# EAGLE design proto_tracks11 (EAGLE 8.6.3)
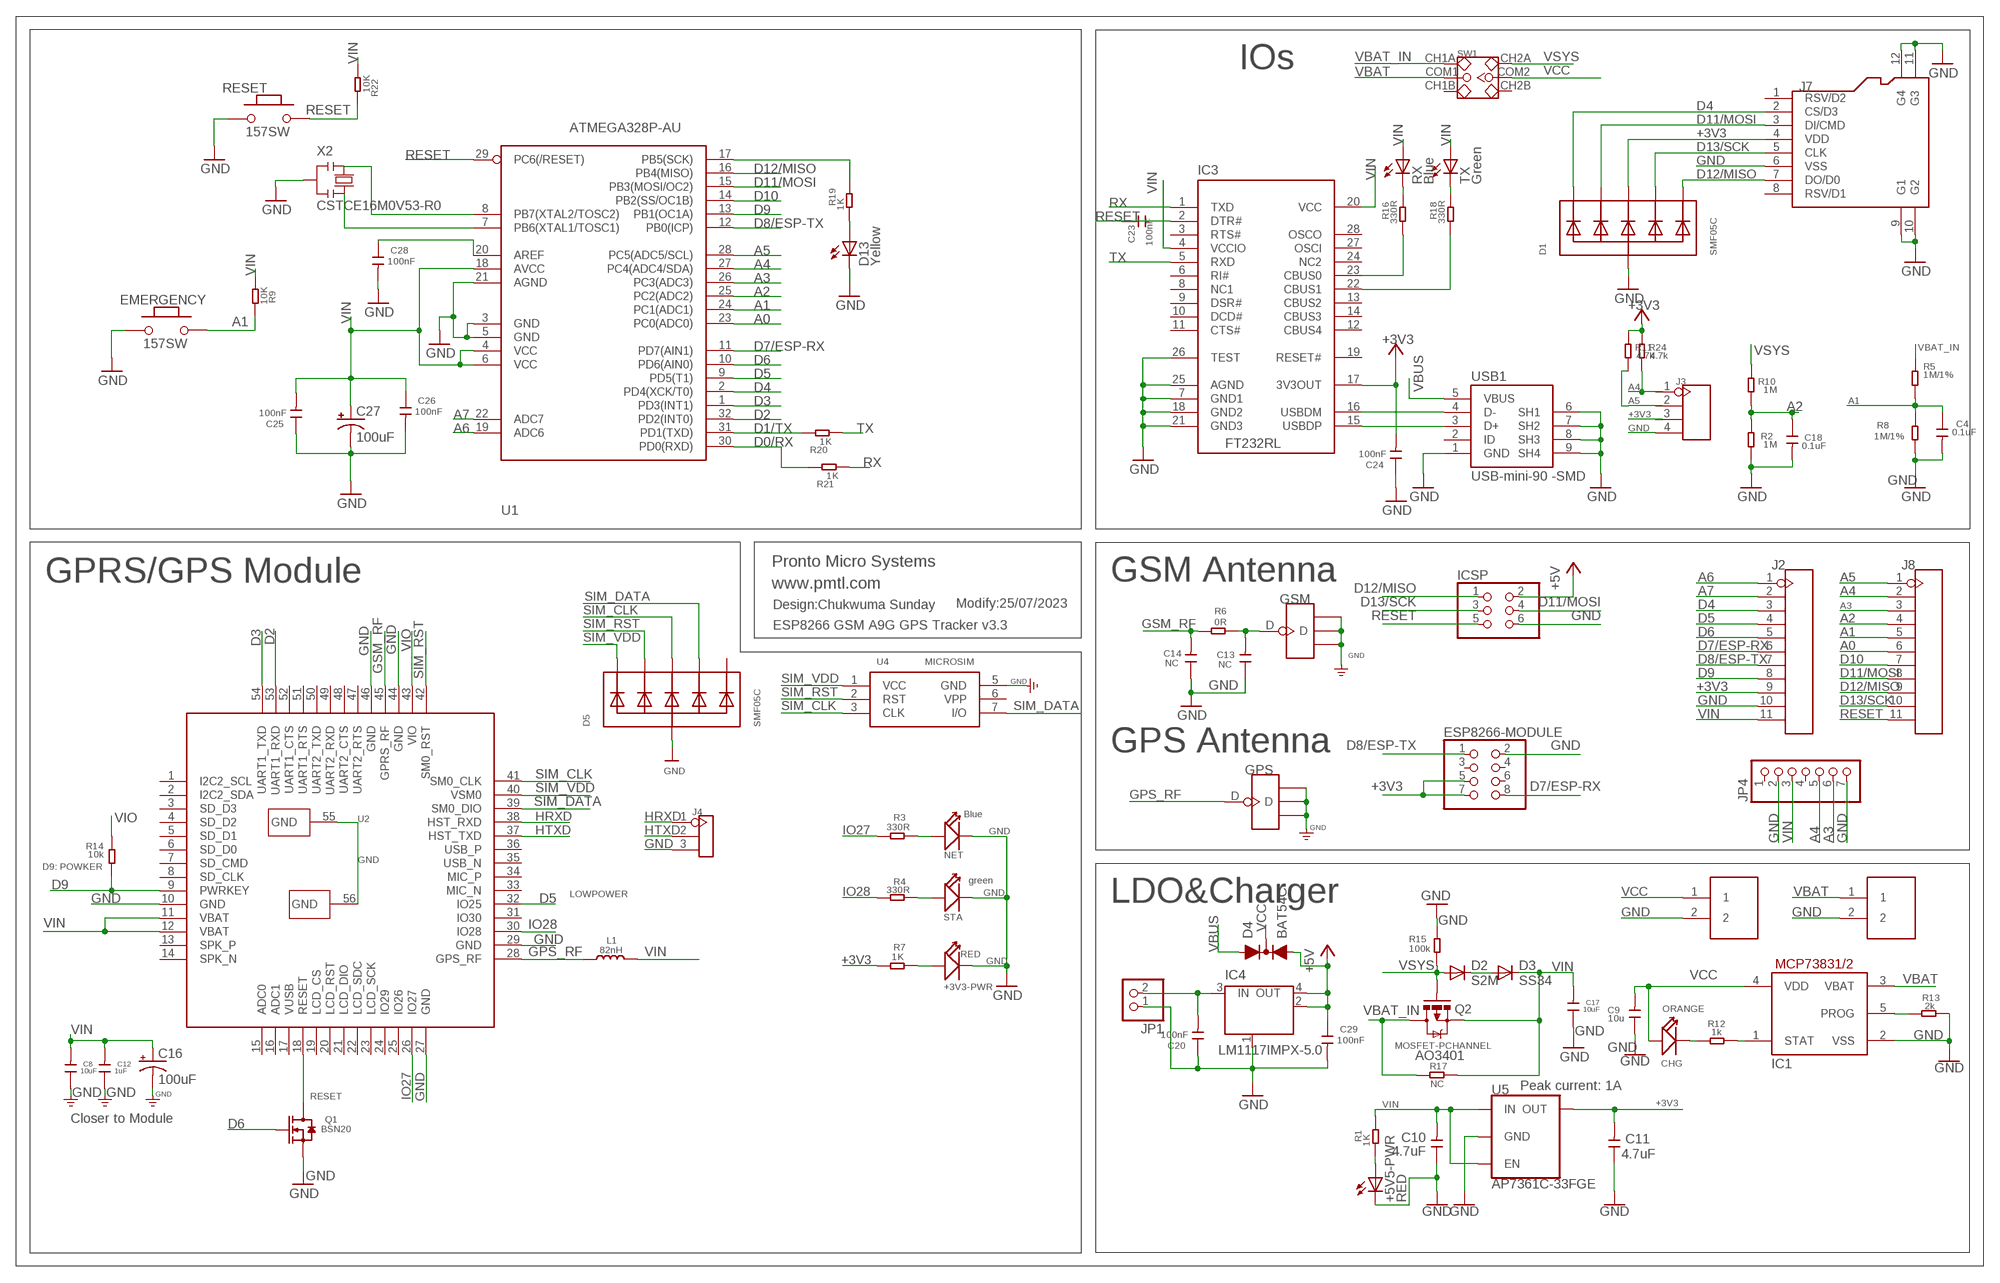
[diagram p0: schematic, sheet 1]

## Parts
+3V3-PWR  RED  LED'0603'  [LED-0603]
+5V5-PWR  RED  OPTO_0043_KPT-2012SGC  [OPTO_CHIPLED_0805]
C4  0.1uF  C-0603  [C0603]
C8  10uF  C-0603  [C0603]
C9  10u  C-0603  [C0603]
C10  4.7uF  C-0603  [C0603]
C11  4.7uF  C-0603  [C0603]
C12  1uF  C-0603  [C0603]
C13  NC  C-0402  [C0402]
C14  NC  C-0402  [C0402]
C16  100uF  68UF-POLAR-EIA3528-10V-10%(TANT)  [EIA3528]
C17  10uF  C-0603  [C0603]
C18  0.1uF  C-0603  [C0603]
C20  100nF  C-0603  [C0603]
C23  100nF  C-0603  [C0603]
C24  100nF  C-0603  [C0603]
C25  100nF  C-0603  [C0603]
C26  100nF  C-0603  [C0603]
C27  100uF  68UF-POLAR-EIA3528-10V-10%(TANT)  [EIA3528]
C28  100nF  C-0603  [C0603]
C29  100nF  C-0603  [C0603]
CHG  ORANGE  007-LED0603  [D0603]
D1  SMF05C  TVSARRAY_5LANE  [SOT363]
D2  S2M  DIODE-DO-214AC  [DO-214AC]
D3  SS34  DIODE-DO-214AC  [DO-214AC]
D4  BAT54C  [SOT23-R]
D5  SMF05C  TVSARRAY_5LANE  [SOT363]
D13  Yellow  OPTO_0044_KPT-2012YC  [OPTO_CHIPLED_0805]
EMERGENCY  157SW  SWITCHES_0173_IT-1185AP1C-160G-G_T&R  [SWITCHES_SMD_157SW]
ESP8266-MODULE  PINHD-2X4  [2X04]
GPS  ANTENNA-U-FL  [4P-U-FL]
GSM  ANTENNA-U-FL  [4P-U-FL]
IC1  MCP73831/OT  [SOT23-5L]
IC3  FT232RL  INTEGRATEDCIRCUITS_0226_FT232RL  [INTEGRATEDCIRCUITS_SSOP28]
IC4  LM1117IMPX-5.0  INTEGRATEDCIRCUITS_0022_LM1117IMPX-5.0  [INTEGRATEDCIRCUITS_LINEAR_SOT223]
ICSP  PINHD-2X3  [2X03]
J1  PH2.0-2P-90-DIP  [PH2.0-2P-90-DIP]
J2  HEADER-11P-2.54  [11P-2.54]
J3  HEADER-4P-60/35MILROUND  [4P-65/35ROUND]
J4  HEADER-3P-2.54  [3P-2.54]
J6  PH2.0-2P-90-DIP  [PH2.0-2P-90-DIP]
J7  HOLDER-MICROSD-8P  [8P-SMD]
J8  HEADER-11P-2.54  [11P-2.54]
JP1  PINHD-1X2  [1X02]
JP4  PINHD-1X7  [1X07]
L1  82nH  L'0603'  [L0603]
NET  Blue  LED'0603'  [LED-0603]
Q1  BSN20  MOSFET-N'SOT23'  [SOT23@1]
Q2  MOSFET-PCHANNEL  [SOT23-3]
R1  1K  R-0603  [R0603]
R2  1M  R-0603  [R0603]
R3  330R  R-0603  [R0603]
R4  330R  R-0603  [R0603]
R5  1M/1%  R-0603  [R0603]
R6  0R  R-0603  [R0603]
R7  1K  R-0603  [R0603]
R8  1M/1%  R-0603  [R0603]
R9  10K  R-0603  [R0603]
R10  1M  R-0603  [R0603]
R11  4.7k  R-0603  [R0603]
R12  1k  R-0603  [R0603]
R13  2k  R-0603  [R0603]
R14  10k  R-0603  [R0603]
R15  100k  R-0603  [R0603]
R16  330R  R-0603  [R0603]
R17  NC  R-0603  [R0603]
R18  330R  R-0603  [R0603]
R19  1K  R-0603  [R0603]
R20  1K  R-0603  [R0603]
R21  1K  R-0603  [R0603]
R22  10K  R-0603  [R0603]
R24  4.7k  R-0603  [R0603]
RESET  157SW  SWITCHES_0173_IT-1185AP1C-160G-G_T&R  [SWITCHES_SMD_157SW]
RX  Blue  OPTO_0181_KTP-2012SURCK  [OPTO_CHIPLED_0805]
STA  green  LED'0603'  [LED-0603]
SW1  SWITCH-2CH-6P  [6P-2CH-2.54-7.6X3.0]
TX  Green  OPTO_0043_KPT-2012SGC  [OPTO_CHIPLED_0805]
U1  ATMEGA328P-AU  ARDUINO-UCS&SOCS_ATMEGA328P-32AU  [ARDUINO-UCS&SOCS_TQFP32-08]
U2  A9G  [A9G]
U4  MICROSIM  [MICROSIM]
U5  AP7361C-33FGE  [8-UDFN]
USB1  USB-mini-90 -SMD  CONNETTORI_0219_14850  [CONNETTORI_USB-MINI-B_2]
X2  CSTCE16M0V53-R0  CRISTALLI_0011_CSTCE16M0V53-R0  [CRISTALLI_RESONATOR]

## Nets
+3V3: C11.2 C24.2 D1.4(C3) ESP8266-MODULE.5 ESP8266-MODULE.7 IC3.17(3V3OUT) J2.9 J3.3 J7.4(VDD) R7.1 R11.2 R24.2 U5.1(OUT)
+5V: C29.1 D4.2(A2) IC4.2(OUT) IC4.4(OUT) ICSP.2
A0: J8.6 U1.23(PC0(ADC0))
A1: C4.1 EMERGENCY.2 J8.5 R5.1 R8.2 R9.2 U1.24(PC1(ADC1))
A2: C18.1 J8.4 R2.2 R10.1 U1.25(PC2(ADC2))
A3: J8.3 JP4.6 U1.26(PC3(ADC3))
A4: J3.1 J8.2 JP4.5 R24.1 U1.27(PC4(ADC4/SDA))
A5: J3.2 J8.1 R11.1 U1.28(PC5(ADC5/SCL))
A6: J2.1 U1.19(ADC6)
A7: J2.2 U1.22(ADC7)
D0/RX: R21.2 U1.30(PD0(RXD))
D1/TX: R20.2 U1.31(PD1(TXD))
D2: U1.32(PD2(INT0)) U2.53(UART1_RXD)
D3: U1.1(PD3(INT1)) U2.54(UART1_TXD)
D4: D1.1(C1) J2.3 J7.2(CS/D3) U1.2(PD4(XCK/T0))
D5: J2.4 U1.9(PD5(T1)) U2.32(IO25)
D6: J2.5 Q1.1(G) U1.10(PD6(AIN0))
D7/ESP-RX: ESP8266-MODULE.8 J2.6 U1.11(PD7(AIN1))
D8/ESP-TX: ESP8266-MODULE.1 J2.7 U1.12(PB0(ICP))
D9: J2.8 R14.1 U1.13(PB1(OC1A)) U2.9(PWRKEY)
D10: J8.7 U1.14(PB2(SS/OC1B))
D11/MOSI: D1.3(C2) ICSP.4 J7.3(DI/CMD) J8.8 U1.15(PB3(MOSI/OC2))
D12/MISO: D1.6(C5) ICSP.1 J7.7(DO/D0) J8.9 U1.16(PB4(MISO))
D13/SCK: D1.5(C4) ICSP.3 J7.5(CLK) J8.10 R19.2 U1.17(PB5(SCK))
GND: +3V3-PWR.- +5V5-PWR.C C4.2 C8.1 C9.1 C10.1 C11.1 C12.1 C13.1 C14.1 C16.C(-) C17.1 C18.2 C20.1 C24.1 C25.1 C26.2 C27.C(-) C28.2 C29.2 D1.2(A) D5.2(A) D13.C EMERGENCY.1 ESP8266-MODULE.2 GPS.GND1 GPS.GND2 GPS.GND3 GSM.GND1 GSM.GND2 GSM.GND3 IC1.2(VSS) IC3.7(GND1) IC3.18(GND2) IC3.21(GND3) IC3.25(AGND) IC3.26(TEST) IC4.1(GND/ADJ) ICSP.6 J1.2 J2.10 J3.4 J4.3 J6.2 J7.6(VSS) J7.9(G1) J7.10(G2) J7.11(G3) J7.12(G4) JP1.1 JP4.2 JP4.7 NET.- Q1.2(S) R2.1 R8.1 R13.2 R15.2 RESET.1 STA.- U1.3(GND) U1.5(GND) U1.21(AGND) U2.10(GND) U2.27(GND) U2.29(GND) U2.44(GND) U2.46(GND) U2.55(GND) U2.56(GND) U4.5(GND) U5.4(GND) U5.EP(GND) USB1.1(GND) USB1.6(SH1) USB1.7(SH2) USB1.8(SH3) USB1.9(SH4) X2.2
GPS_RF: GPS.D L1.1 U2.28(GPS_RF)
GSM_RF: C14.2 R6.1 U2.45(GPRS_RF)
HRXD: J4.1 U2.38(HST_RXD)
HTXD: J4.2 U2.37(HST_TXD)
IO27: R3.1 U2.26(IO27)
IO28: R4.1 U2.30(IO28)
N$1: R4.2 STA.+
N$2: D2.C D3.A
N$3: +3V3-PWR.+ R7.2
N$4: C28.1 U1.20(AREF)
N$5: +5V5-PWR.A R1.1
N$6: C20.2 IC4.3(IN) JP1.2
N$7: NET.+ R3.2
N$8: Q1.3(D) U2.18(RESET)
N$9: C23.2 IC3.2(DTR#)
N$10: R16.2 RX.C
N$11: R18.2 TX.C
N$12: IC3.23(CBUS0) R16.1
N$13: IC3.22(CBUS1) R18.1
N$14: IC3.15(USBDP) USB1.3(D+)
N$15: IC3.16(USBDM) USB1.4(D-)
N$16: D13.A R19.1
N$25: CHG.- R12.1
N$26: IC1.1(STAT) R12.2
N$31: IC1.5(PROG) R13.1
N$44: U1.7(PB6(XTAL1/TOSC1)) X2.3
N$49: U1.8(PB7(XTAL2/TOSC2)) X2.1
N$94: C13.2 GSM.D R6.2
RESET: C23.1 ICSP.5 J8.11 R22.2 RESET.2 U1.29(PC6(/RESET))
RX: IC3.1(TXD) R21.1
SIM_CLK: D5.4(C3) U2.41(SM0_CLK) U4.3(CLK)
SIM_DATA: D5.5(C4) U2.39(SM0_DIO) U4.7(I/O)
SIM_RST: D5.3(C2) U2.42(SM0_RST) U4.2(RST)
SIM_VDD: D5.1(C1) U2.40(VSM0) U4.1(VCC)
TX: IC3.5(RXD) R20.1
VBAT: IC1.3(VBAT) J6.1 SW1.COM1
VBAT_IN: Q2.3(D) R5.2 R17.1 SW1.CH1A
VBUS: D4.1(A1) USB1.5(VBUS)
VCC: C9.2 CHG.+ D4.3(C) IC1.4(VDD) J1.1 SW1.COM2
VIN: C8.2 C10.2 C12.2 C16.A(+) C17.2 C25.2 C26.1 C27.A(+) D3.C IC3.4(VCCIO) IC3.20(VCC) J2.11 JP4.3 L1.2 Q2.2(S) R1.2 R9.1 R17.2 R22.1 RX.A TX.A U1.4(VCC) U1.6(VCC) U1.18(AVCC) U2.11(VBAT) U2.12(VBAT) U5.5(EN) U5.8(IN)
VIO: R14.2 U2.43(VIO)
VSYS: D2.A Q2.1(G) R10.2 R15.1 SW1.CH2A
Unconnected: D5.6(C5) ESP8266-MODULE.3 ESP8266-MODULE.4 ESP8266-MODULE.6 IC3.3(RTS#) IC3.6(RI#) IC3.8(NC1) IC3.9(DSR#) IC3.10(DCD#) IC3.11(CTS#) IC3.12(CBUS4) IC3.13(CBUS2) IC3.14(CBUS3) IC3.19(RESET#) IC3.24(NC2) IC3.27(OSCI) IC3.28(OSCO) J7.1(RSV/D2) J7.8(RSV/D1) JP4.1 JP4.4 SW1.CH1B SW1.CH2B U2.1(I2C2_SCL) U2.2(I2C2_SDA) U2.3(SD_D3) U2.4(SD_D2) U2.5(SD_D1) U2.6(SD_D0) U2.7(SD_CMD) U2.8(SD_CLK) U2.13(SPK_P) U2.14(SPK_N) U2.15(ADC0) U2.16(ADC1) U2.17(VUSB) U2.19(LCD_CS) U2.20(LCD_RST) U2.21(LCD_DIO) U2.22(LCD_SDC) U2.23(LCD_SCK) U2.24(IO29) U2.25(IO26) U2.31(IO30) U2.33(MIC_N) U2.34(MIC_P) U2.35(USB_N) U2.36(USB_P) U2.47(UART2_RTS) U2.48(UART2_CTS) U2.49(UART2_RXD) U2.50(UART2_TXD) U2.51(UART1_RTS) U2.52(UART1_CTS) U4.6(VPP) USB1.2(ID)

## Notes on the sheet
- IOs
- Pronto Micro Systems
- GPRS/GPS Module | GSM Antenna
- www.pmtl.com
- Design:Chukwuma Sunday | Modify:25/07/2023
- ESP8266 GSM A9G GPS Tracker v3.3
- GPS Antenna
- D9: POWKER
- LOWPOWER
- LDO&Charger
- AO3401
- Peak current: 1A
- RESET
- Closer to Module

## Library data of the parts
+3V3-PWR NET STA = Discrete:LED*
+5V5-PWR = SUNIOANO_SCHEMATIC22:OPTO_0043_KPT-2012SGC: LED GREEN - SMD-0805; MONTHLY_USAGE: _____; PART_NUMBER: KPT-2012SGC; PRICE: _____; SUPPLIER: _____; TYPE: Opto; VALUE: Green
C4 C8-C14 C17 C18 C20 C23-C26 C28 C29 = Discrete:C*: Ceramic Capacitors
C16 C27 = SparkFun-Capacitors:68UF-POLAR: 68µF polarized capacitors A capacitor is a passive two-terminal electrical component used to store electrical energy temporarily in an electric field.; PROD_ID: CAP-10790; VALUE: 68uF
CHG = Discrete:007-LED*
D1 D5 = microbuilder:TVSARRAY_5LANE: Voltage Transient Suppressor Array SOT363 SMF05C - 100W 5V: Digikey - SMF05CT1GOSCT-ND
D2 D3 = diode:DIODE-: DIODE
D4 = BAT54C:BAT54C: BAT54C Schottky Diodes (Common Cathode) 30V 200mA, SOT-23 Package Digikey: BAT54CFSCT-ND Check availability <https://pricing.snapeda.com/parts/BAT54C/Diotec%20Semiconductor/view-part?ref=eda>; AVAILABILITY: In Stock; DESCRIPTION: Diode Array 1 Pair Common Cathode Schottky 30 V 200mA Surface Mount TO-236-3, SC-59, SOT-23-3; MF: Diotec Semiconductor; MP: BAT54C; PACKAGE: SOT-23-3 Diotec; PRICE: None
D13 = SUNIOANO_SCHEMATIC22:OPTO_0044_KPT-2012YC: LED YELLOW - SMD - 0805; MONTHLY_USAGE: _____; PART_NUMBER: KPT-2012YC; PRICE: _____; SUPPLIER: _____; TYPE: Opto
EMERGENCY RESET = SUNIOANO_SCHEMATIC22:SWITCHES_0173_IT-1185AP1C-160G-G_T&R: Pushbutton 4x3 SMD H2,5mm; MONTHLY_USAGE: _____; PART_NUMBER: IT-1185AP1C-160G-G_T&R; PRICE: _____; SUPPLIER: _____; TYPE: Switches
ESP8266-MODULE = pinhead:PINHD-2X4: PIN HEADER
GPS GSM = Connector:ANTENNA-U-FL
IC1 = adafruit:MCP73831: MCP73831/2 Miniature Single-Cell, Fully Integrated Li-Ion, Li-Polymer Charge Management Controllers. Nice and small simple lipoly charge controller, with adjustable current and status output (LED) http://www.ladyada.net/library/pcb/eaglelibrary.html
IC3 = SUNIOANO_SCHEMATIC22:INTEGRATEDCIRCUITS_0226_FT232RL: USB to serial UART interface -FT232RL; CASE: SSOP28; MONTHLY_USAGE: _____; PART_NUMBER: FT232RL; PRICE: _____; SUPPLIER: _____; TYPE: Circuito_Integrato
IC4 = SUNIOANO_SCHEMATIC22:INTEGRATEDCIRCUITS_0022_LM1117IMPX-5.0: Low-dropout linear regulator 5V -LM1117IMPX-5.0; CASE: SOT223; MONTHLY_USAGE: _____; PART_NUMBER: LM1117IMPX-5.0; PRICE: _____; SUPPLIER: _____; TYPE: Circuito_Integrato
ICSP = pinhead:PINHD-2X3: PIN HEADER
J1 J6 = Connector:PH2.0-2P-90-DIP
J2 J8 = Connector:HEADER-11P
J3 = Connector:HEADER-4P
J4 = Connector:HEADER-3P
J7 = Connector:HOLDER-MICROSD-8P
JP1 = pinhead:PINHD-1X2: PIN HEADER
JP4 = pinhead:PINHD-1X7: PIN HEADER
L1 = Discrete:L*
Q1 = Discrete:MOSFET-N: IRLL014: http://www.vishay.com/docs/91319/sihll014.pdf
Q2 = User-Submitted:MOSFET-PCHANNEL: Generic PMOSFET IRLML2244 - TRANS-11153 (SOT-23 -20V -4.3A) (1.Gate 2.Source 3.Drain) FQP27P06 - COM-10349 <http://www.sparkfun.com/products/10349> (TO-220 -60V -27A) (1.Gate 2.Source 3.Drain); PROD_ID: TRANS-08285
R1-R22 R24 = Discrete:R*
RX = SUNIOANO_SCHEMATIC22:OPTO_0181_KTP-2012SURCK: LED RED - SMD - 0805; MONTHLY_USAGE: _____; PART_NUMBER: KTP-2012SURCK; PRICE: _____; SUPPLIER: _____; TYPE: Opto; VALUE: Red
SW1 = Discrete:SWITCH-2CH-6P
TX = SUNIOANO_SCHEMATIC22:OPTO_0043_KPT-2012SGC: LED GREEN - SMD-0805; MONTHLY_USAGE: _____; PART_NUMBER: KPT-2012SGC; PRICE: _____; SUPPLIER: _____; TYPE: Opto
U1 = SUNIOANO_SCHEMATIC22:ARDUINO-UCS&SOCS_ATMEGA328P-32: 8-bit Microcontroller with 32KBytes In-System Programmable Flash ATMEGA328P-AU; DATASHEET: http://www.atmel.com/images/Atmel-8271-8-bit-AVR-Microcontroller-ATmega48A-48PA-88A-88PA-168A-168PA-328-328P_datasheet_Complete.pdf; DISTRIBUTOR-LINK: https://www.digikey.it/product-detail/it/microchip-technology/ATMEGA328P-AU/ATMEGA328P-AU-ND/1832260; DISTRIBUTOR-PN: ATMEGA328P-AU-ND; MANUFACTURER: ATMEL; MANUFACTURER-PN: ATMEGA328P-AU
U2 = A9G:A9G
U4 = Connector:MICROSIM
U5 = ublox:AP7361C-33FGE: AP7361C 3.3V LDO Regulator; PROD_ID: VREG-14094
USB1 = SUNIOANO_SCHEMATIC22:CONNETTORI_0219_14850: Usb-Mini F 90 Smd; MONTHLY_USAGE: _____; PART_NUMBER: 14850; PRICE: _____; SUPPLIER: _____; TYPE: Connettori
X2 = SUNIOANO_SCHEMATIC22:CRISTALLI_0011_CSTCE16M0V53-R0: 16Mhz - SMD; MONTHLY_USAGE: _____; PART_NUMBER: CSTCE16M0V53-R0; PRICE: _____; SUPPLIER: _____; TYPE: Cristalli

## Net classes
0 default: width 0.203 mm, drill 0.305 mm, clearance 0.152 mm
2 gnd: width 0.305 mm, drill 0.559 mm, clearance 0.254 mm
3 usbvcc: width 0.508 mm, drill 0.61 mm, clearance 0.254 mm
4 USBpair: width 0.254 mm, drill 0.406 mm, clearance 0.406 mm

## Board
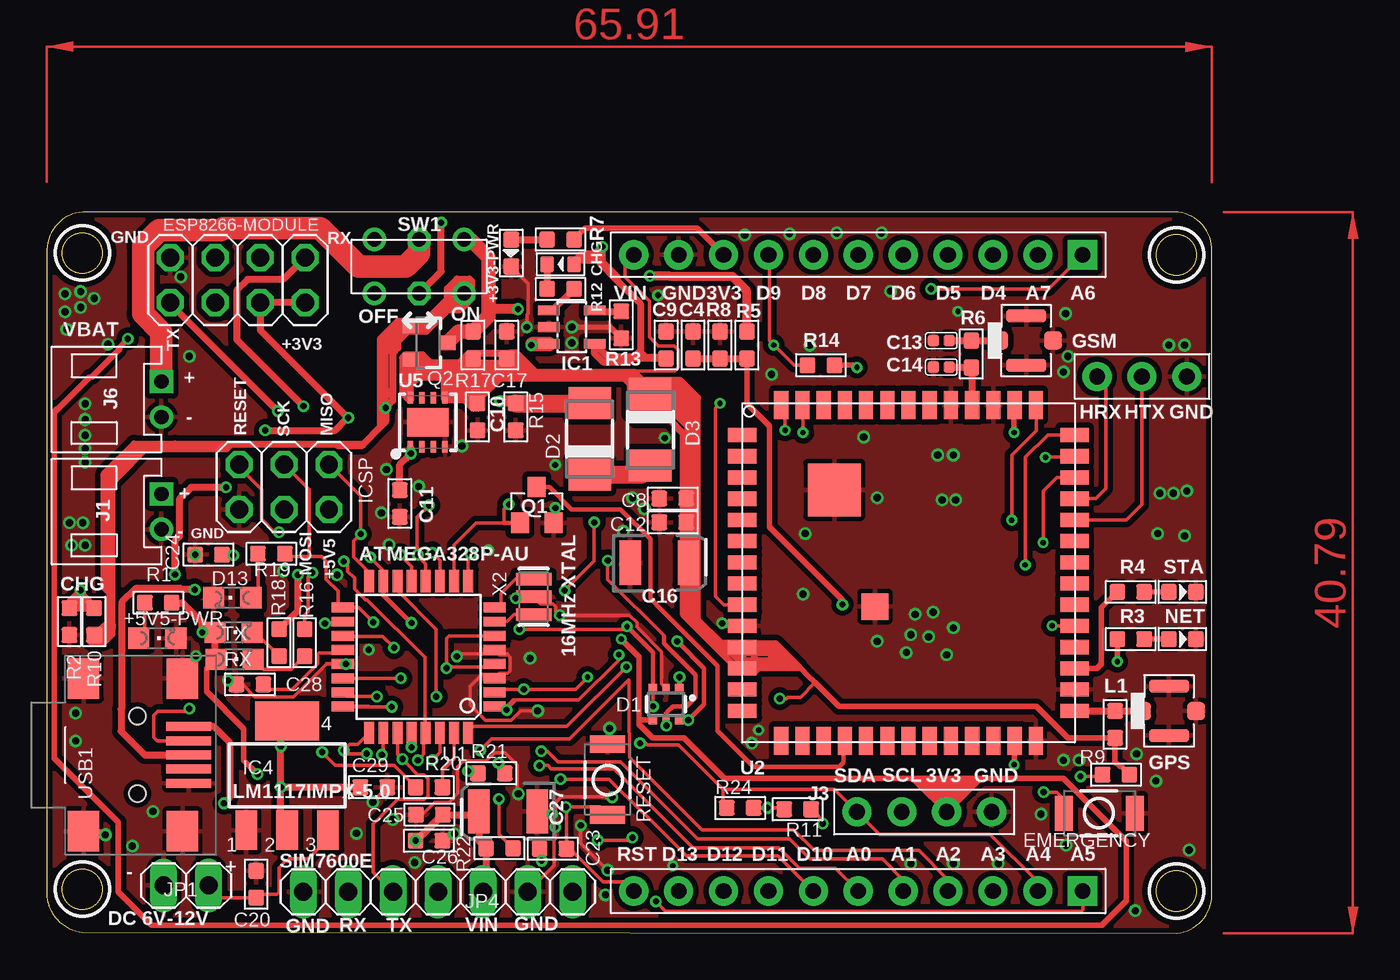
[diagram p1: board, top side]
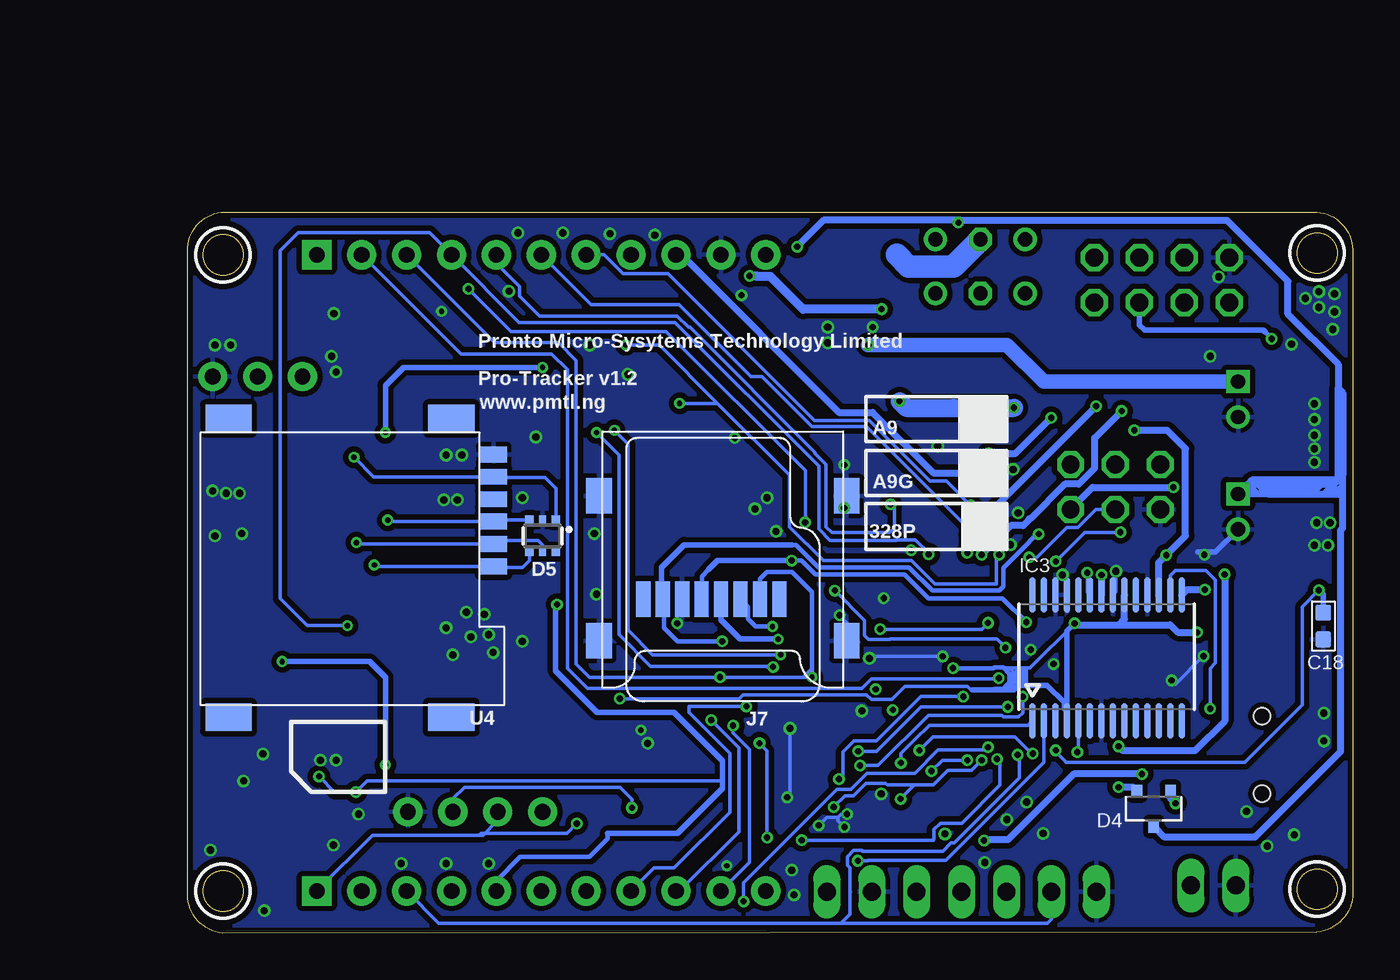
[diagram p2: board, bottom side, seen from below]

Size 65.92 x 40.79 mm. Coordinates in mm from the lower left corner, seen from the top.
Outline: 0.01,38.48 0.01,2.48 arc90 2.03,0.05 63.93,0 arc90 65.91,2.38 65.91,38.38 arc90 64.01,40.79 2.03,40.79 arc90 0.01,38.48
Outline: circle at 63.91,2.38 radius 1.14
Outline: circle at 63.91,38.38 radius 1.14
Outline: circle at 2.01,2.48 radius 1.14
Outline: circle at 2.01,38.48 radius 1.14
Copper layers (1*16): Top 0.035mm / dielectric 1.5mm / Bottom 0.035mm
Design rules "default": minimum track width 6mil, minimum drill 10mil, track to track 6mil, track to pad 6mil, pad to pad 6mil, via to via 6mil, smd to smd 0mil, copper to edge 10mil, drill to drill 10mil, minimum pad ring 10mil, minimum via ring 6mil, stop-mask expansion 2mil, vias tented up to drill 100mil, thermal gap 10mil
tRestrict: area 62.4,0.9 to 65.4,3.9; area 62.4,36.9 to 65.4,39.9; area 0.5,1 to 3.5,4; area 0.5,37 to 3.5,40
bRestrict: area 62.4,0.9 to 65.4,3.9; area 62.4,36.9 to 65.4,39.9; area 0.5,1 to 3.5,4; area 0.5,37 to 3.5,40

### Footprints (pad centres in the part's own frame; a part is rotated, then mirrored left to right if it is on the bottom)
LED-0603 = smd 0.889 x 0.889: + -0.762,0; - 0.762,0
OPTO_CHIPLED_0805 = smd 1.2 x 1.2: A 0,-1.05; C 0,1.05
C0603 = smd 0.889 x 0.889: 1 -0.762,0; 2 0.762,0
C0402 = smd 0.635 x 0.635: 1 -0.445,0; 2 0.445,0
EIA3528 = smd 1.2 x 2.5: A 1.65,0; C -1.65,0
D0603 = smd 0.762 x 0.889: + -0.762,0; - 0.762,0
SOT363 = smd 0.5 x 0.5: 1 -0.75,-0.9; 3 0.75,-0.9; 4 0.75,0.9; 6 -0.75,0.9 | smd 0.4 x 0.5: 2 0,-0.9; 5 0,0.9
DO-214AC = smd 1.8 x 2.4: A 2.025,0; C -2.025,0
SOT23-R = smd 0.6 x 0.7: 1 -0.95,-1; 2 0.95,-1; 3 0,1
SWITCHES_SMD_157SW = smd 1.016 x 1.981: 1 0,0; 2 4,0
2X04 = drill 1.016 octagon: 1 -3.81,-1.27; 2 -3.81,1.27; 3 -1.27,-1.27; 4 -1.27,1.27; 5 1.27,-1.27; 6 1.27,1.27; 7 3.81,-1.27; 8 3.81,1.27
4P-U-FL = smd 1.016 x 1.016: D -1.524,0; GND3 1.524,0 | smd 2.286 x 0.762: GND1 0,1.397; GND2 0,-1.397
SOT23-5L = smd 0.55 x 1.2: 1 -0.95,-1.3; 2 0,-1.3; 3 0.95,-1.3; 4 0.95,1.3; 5 -0.95,1.3
INTEGRATEDCIRCUITS_SSOP28 = smd 0.381 x 2.032: 1 0,0; 2 0.65,0; 3 1.3,0; 4 1.95,0; 5 2.6,0; 6 3.25,0; 7 3.9,0; 8 4.55,0; 9 5.2,0; 10 5.85,0; 11 6.5,0; 12 7.15,0; 13 7.8,0; 14 8.45,0; 15 8.45,7.112; 16 7.8,7.112; 17 7.15,7.112; 18 6.5,7.112; 19 5.85,7.112; 20 5.2,7.112; 21 4.55,7.112; 22 3.9,7.112; 23 3.25,7.112; 24 2.6,7.112; 25 1.95,7.112; 26 1.3,7.112; 27 0.65,7.112; 28 0,7.112
INTEGRATEDCIRCUITS_LINEAR_SOT223 = smd 1.219 x 2.235: 1 -2.311,-3.099; 2 0,-3.099; 3 2.311,-3.099 | smd 3.6 x 2.2: 4 0,3.099
2X03 = drill 1.016 octagon: 1 -2.54,-1.27; 2 -2.54,1.27; 3 0,-1.27; 4 0,1.27; 5 2.54,-1.27; 6 2.54,1.27
PH2.0-2P-90-DIP = drill 0.8 square: 1 0,1 | drill 0.8: 2 0,-1
11P-2.54 = drill 0.889 pad 1.651 square: 1 0,12.7 | drill 0.889 pad 1.651: 2 0,10.16; 3 0,7.62; 4 0,5.08; 5 0,2.54; 6 0,0; 7 0,-2.54; 8 0,-5.08; 9 0,-7.62; 10 0,-10.16; 11 0,-12.7
4P-65/35ROUND = drill 0.889 pad 1.651: 1 0,3.81; 2 0,1.27; 3 0,-1.27; 4 0,-3.81
3P-2.54 = drill 0.9 pad 1.651: 1 0,2.54; 2 0,0; 3 0,-2.54
8P-SMD = smd 0.8 x 2.008: 1 -3.198,0.254; 2 -2.098,0.254; 3 -0.998,0.254; 4 0.102,0.254; 5 1.202,0.254; 6 2.302,0.254; 7 3.402,0.254; 8 4.502,0.254 | smd 1.45 x 2: 9 -7.002,2.6; 10 7.002,2.6; 11 -7.002,-5.598; 12 7.002,-5.598
1X02 = drill 1.016 long: 1 -1.27,0; 2 1.27,0
1X07 = drill 1.016 long: 1 -7.62,0; 2 -5.08,0; 3 -2.54,0; 4 0,0; 5 2.54,0; 6 5.08,0; 7 7.62,0
L0603 = smd 0.889 x 0.889: 1 -0.762,0; 2 0.762,0
SOT23@1 = smd 1.016 x 1.143: 1 -0.95,-1.016; 2 0.95,-1.016; 3 0,1.016
SOT23-3 = smd 0.8 x 0.9: 1 -0.95,-1; 2 0.95,-1; 3 0,1.1
R0603 = smd 0.889 x 0.889: 1 -0.762,0; 2 0.762,0
6P-2CH-2.54-7.6X3.0 = drill 0.813 pad 1.27: CH1A -1.524,2.54; CH1B -1.524,-2.54; CH2A 1.524,2.54; CH2B 1.524,-2.54 | drill 0.813 pad 1.27 octagon: COM1 -1.524,0; COM2 1.524,0
ARDUINO-UCS&SOCS_TQFP32-08 = smd 1.27 x 0.559: 1 -4.293,2.8; 2 -4.293,2; 3 -4.293,1.2; 4 -4.293,0.4; 5 -4.293,-0.4; 6 -4.293,-1.2; 7 -4.293,-2; 8 -4.293,-2.8; 17 4.293,-2.8; 18 4.293,-2; 19 4.293,-1.2; 20 4.293,-0.4; 21 4.293,0.4; 22 4.293,1.2; 23 4.293,2; 24 4.293,2.8 | smd 0.559 x 1.27: 9 -2.8,-4.293; 10 -2,-4.293; 11 -1.2,-4.293; 12 -0.4,-4.293; 13 0.4,-4.293; 14 1.2,-4.293; 15 2,-4.293; 16 2.8,-4.293; 25 2.8,4.293; 26 2,4.293; 27 1.2,4.293; 28 0.4,4.293; 29 -0.4,4.293; 30 -1.2,4.293; 31 -2,4.293; 32 -2.8,4.293
A9G = smd 1.6 x 0.8: 1 -9.4,7.8; 2 -9.4,6.6; 3 -9.4,5.4; 4 -9.4,4.2; 5 -9.4,3; 6 -9.4,1.8; 7 -9.4,0.6; 8 -9.4,-0.6; 9 -9.4,-1.8; 10 -9.4,-3; 11 -9.4,-4.2; 12 -9.4,-5.4; 13 -9.4,-6.6; 14 -9.4,-7.8; 28 9.4,-7.8; 29 9.4,-6.6; 30 9.4,-5.4; 31 9.4,-4.2; 32 9.4,-3; 33 9.4,-1.8; 34 9.4,-0.6; 35 9.4,0.6; 36 9.4,1.8; 37 9.4,3; 38 9.4,4.2; 39 9.4,5.4; 40 9.4,6.6; 41 9.4,7.8 | smd 0.8 x 1.6: 15 -7.2,-9.5; 16 -6,-9.5; 17 -4.8,-9.5; 18 -3.6,-9.5; 19 -2.4,-9.5; 20 -1.2,-9.5; 21 0,-9.5; 22 1.2,-9.5; 23 2.4,-9.5; 24 3.6,-9.5; 25 4.8,-9.5; 26 6,-9.5; 27 7.2,-9.5; 42 7.2,9.5; 43 6,9.5; 44 4.8,9.5; 45 3.6,9.5; 46 2.4,9.5; 47 1.2,9.5; 48 0,9.5; 49 -1.2,9.5; 50 -2.4,9.5; 51 -3.6,9.5; 52 -4.8,9.5; 53 -6,9.5; 54 -7.2,9.5 | smd 3 x 3: 55 -4.2,4.7 | smd 1.5 x 1.5: 56 -1.9,-1.9
MICROSIM = smd 1.5 x 0.9: 1 -0.8,2.5; 2 -0.8,5.04; 3 -0.8,7.58; 5 -0.8,1.23; 6 -0.8,3.77; 7 -0.8,6.31 | smd 2.61 x 1.56: P$1 1.6,-0.8; P$2 14.2,-0.8; P$3 14.2,16.1; P$4 1.6,16.1
8-UDFN = smd 0.3 x 0.65: 1 -0.975,-1.375; 2 -0.325,-1.375; 3 0.325,-1.375; 4 0.975,-1.375; 5 0.975,1.375; 6 0.325,1.375; 7 -0.325,1.375; 8 -0.975,1.375 | smd 2.35 x 1.6: EP 0,0
CONNETTORI_USB-MINI-B_2 = smd 0.508 x 2.54: 1 0,0; 2 0.8,0; 3 1.6,0; 4 2.4,0; 5 3.2,0 | smd 2.286 x 1.778: 6 -2.717,5.948; 7 -2.717,0.36; 8 5.918,0.36; 9 5.918,5.948 | hole 0.95: -0.6,2.9; 3.8,2.9
CRISTALLI_RESONATOR = smd 0.7 x 2: 1 -1,0; 2 0,0; 3 1,0

### Placement (x,y rotation side)
+3V3-PWR  26.27,38.48 270 top
+5V5-PWR  6.26,16.69 270 top
C4  36.56,33.27 90 top
C8  35.42,24.59 0 top
C9  35.04,33.27 270 top
C10  24.37,29.21 90 top
C11  19.97,24.31 90 top
C12  35.42,23.24 0 top
C13  50.61,33.53 0 top
C14  50.61,32.03 0 top
C16  34.65,20.96 0 top
C17  26.02,33.27 270 top
C18  1.66,17.37 270 bottom
C20  11.85,2.77 270 top
C23  28.64,4.78 180 top
C24  9.15,21.41 0 top
C25  21.65,6.71 0 top
C26  21.62,5.23 0 top
C27  26.1,6.88 180 top
C28  11.49,14.07 180 top
C29  18.5,8.25 0 top
CHG  29.07,37.85 180 top
D1  35.04,12.95 180 top
D2  30.72,27.97 90 top
D3  34.15,28.47 270 top
D4  11.26,7.04 180 bottom
D5  45.83,22.48 180 bottom
D13  10.5,18.97 90 top
EMERGENCY  61.55,6.78 180 top
ESP8266-MODULE  10.8,36.96 0 top
GPS  63.48,12.57 0 top
GSM  55.41,33.53 0 top
IC1  29.7,34.29 270 top
IC3  18.12,12.01 0 bottom
IC4  13.6,8.92 0 top
ICSP  13.42,25.25 180 top
J1  6.49,23.85 0 top
J2  45.91,38.38 270 top
J3  49.64,6.86 90 top
J4  61.96,31.5 90 top
J6  6.49,30.2 0 top
J7  35.63,19.14 180 bottom
J8  45.91,2.38 270 top
JP1  7.88,2.69 0 top
JP4  22.13,2.34 180 top
L1  60.44,11.81 270 top
NET  64.25,16.64 0 top
Q1  27.72,24.23 0 top
Q2  21.57,33.4 270 top
R1  6.31,18.69 0 top
R2  1.28,17.63 90 top
R3  61.32,16.64 0 top
R4  61.32,19.3 0 top
R5  39.61,33.27 90 top
R6  52.31,32.77 90 top
R7  29.07,39.24 180 top
R8  38.08,33.27 270 top
R9  60.49,8.97 180 top
R10  2.68,17.63 270 top
R11  42.48,7.01 180 top
R12  29.07,36.45 0 top
R13  32.5,34.42 270 top
R14  43.8,32.13 0 top
R15  26.53,29.21 270 top
R16  14.59,16.43 270 top
R17  24.11,33.27 270 top
R18  13.14,16.43 270 top
R19  12.71,21.46 0 top
R20  21.62,8.25 0 top
R21  25.16,9.04 180 top
R22  25.61,4.8 0 top
R24  39.23,7.09 0 top
RESET  31.73,10.69 270 top
RX  10.63,15.49 270 top
STA  64.25,19.3 0 top
SW1  21.07,37.72 270 top
TX  10.58,17.02 270 top
U1  21.04,15.62 180 top
U2  48.75,20.38 0 top
U4  49.4,28.32 180 bottom
U5  21.55,28.91 0 top
USB1  8.04,8.48 90 top
X2  27.54,19.02 270 top

### Tracks (layer width: path | path; a pad name or v marks a point on that pad's centre or on a via)
+3V3  (via drill 0.3, 0.35)
  Top 0.203: R11.2 41.64,7.09 v40.78,7.09 R24.2
  Top 0.254: 0.42,28.83 0.42,29.46
  Top 0.305: J2.9 36.79,39.88 30.46,39.88 R7.1 | v32.5,16.64 33.51,15.62 33.51,12.06 | 49.01,8.76 38.34,8.76 36.05,11.05 34.27,11.05 33.51,11.81 33.51,12.06 | 49.01,8.76 49.26,8.76 | 50.91,8.76 52.31,8.76 | 52.31,8.76 52.82,8.76 | J3.3 50.91,8.76 | 50.91,8.76 49.26,8.76 | 49.26,8.76 49.26,8.51 | 49.26,8.51 J3.3 | J3.3 52.31,8.25 | 52.31,8.25 52.31,8.64 | 52.31,8.76 52.31,8.64 | 52.31,8.64 51.04,7.37 50.91,7.37 50.78,7.24 50.78,7.37 49.51,8.64 51.93,8.64 52.05,8.51 51.8,8.51 51.04,7.75 50.66,7.75 50.66,7.87 50.02,8.51 51.42,8.51 51.55,8.38 51.42,8.38 51.29,8.25 | 51.29,8.25 51.04,8 50.78,8 50.4,8.38 51.16,8.38 51.29,8.25 | 52.82,8.76 57.51,8.76 61.07,5.21 61.07,1.83 59.69,0.45 14.03,0.45 6.31,0.45 5.93,0.45 4.05,2.34 4.05,6.27 0.42,9.9 0.42,28.83 0.42,29.46 | 52.82,8.76 52.31,8.25 | 49.01,8.76 49.26,8.51 | D1.4 33.52,12.05 33.51,12.06 | 0.42,29.46 0.42,29.54 | 0.54,29.67 0.62,29.67 | 4.56,33.63 v4.58,33.63 4.12,33.17 4.12,33.05 2.54,31.47 2.42,31.47 0.62,29.67 | 0.42,29.46 0.62,29.67
  Top 0.406: U5.1 v20.6,27.14 19.97,26.51 C11.2 | v10.55,21.39 9.94,21.39 C24.2 | ESP8266-MODULE.7 ESP8266-MODULE.5 12.07,34.12 17.03,29.16 | 17.03,29.16 v17.05,29.16 | v12.35,28.45 16.32,28.45 17.03,29.16
  Bottom 0.203: v40.78,7.09 40.78,7.57 41.46,8.25 50.25,8.25 50.91,7.6 J3.3
  Bottom 0.254: 35.8,18.82 J7.4 | 4.95,34 v4.58,33.63
  Bottom 0.305: J7.4 35.73,17.72 34.65,16.64 v32.5,16.64 | ESP8266-MODULE.5 12.07,34.42 11.77,34.11 5.06,34.11 4.95,34
  Bottom 0.406: J2.9 37.98,38.38 29.07,29.46 27.16,29.46 23.73,26.04 21.7,26.04 v20.6,27.14 19.07,27.14 v17.05,29.16 | IC3.17 10.97,20.97 v10.55,21.39 9.46,22.48 9.46,27.41 10.5,28.45 v12.35,28.45
+5V  (via drill 0.35)
  Top 0.406: 10.07,25.22 v10.14,25.22 8.16,25.22 7.5,24.55 7.5,22.43 7.25,22.18 v7.25,20.3 | IC4.4 13.24,11.66 v13.24,10.57 v13.24,8.25 | IC4.2 13.24,6.17 v13.24,8.25 | 17.71,8.23 C29.1 v13.24,8.25
  Bottom 0.406: ICSP.2 14.72,25.22 v10.14,25.22 | v7.25,20.3 7.25,11.99 8.92,10.31 12.99,10.31 v13.24,10.57 | D4.2 12.43,8.25 v13.24,8.25
A0  (via drill 0.35)
  Top 0.203: J8.6 44.63,3.66 42.58,3.66 41.41,4.83 36.56,4.83 32.09,9.29 28.54,9.29 28.36,9.48 v27.87,9.48 | U1.23 16.99,13.38 v18.67,13.38
  Bottom 0.203: v18.67,13.38 18.67,12.46 18.92,12.22 19.76,12.22 19.86,12.32 24.01,12.32 26.85,9.48 v27.87,9.48
A1  (via drill 0.35)
  Top 0.203: J8.5 48.45,3.02 47.27,4.19 43.16,4.19 42.02,5.33 36.81,5.33 32.46,9.69 28.93,9.69 28.33,10.29 v27.97,10.29 | v56.4,7.98 57.13,7.98 57.39,7.72 57.39,6.95 EMERGENCY.2 | R9.2 59.62,8.87 v58.48,8.87 | 18.25,12.8 18.65,12.8 v19.52,12.8 | 16.59,12.82 U1.24 18.23,12.82 18.25,12.8 | 16.59,12.82 16.54,12.87 | 18.25,12.8 16.6,12.8 16.59,12.82
  Top 0.305: R5.1 39.61,29.97 40.88,28.7 40.88,22.99 45.01,18.85 v45.01,18.59
  Top 0.406: C4.1 R8.2 R5.1
  Bottom 0.203: v19.52,12.8 24.42,12.8 26.93,10.29 v27.97,10.29 | 35.65,8.61 55.76,8.61 v56.4,7.98 57.59,7.98 v58.48,8.87
  Bottom 0.254: 42.15,5.64 42.15,5.33 43.16,4.32 47.1,4.32 48.45,2.97 J8.5
  Bottom 0.305: 42.15,5.64 38.19,5.64 35.65,8.18 35.65,8.61 35.65,9.75 38.39,12.5 42.76,12.5 45.09,14.83 45.09,18.51 v45.01,18.59
A2  (via drill 0.35)
  Top 0.203: J8.4 50.99,3.02 49.33,4.67 43.42,4.67 42.25,5.84 37.07,5.84 32.98,9.93 32.98,11.31 32.93,11.36 32.93,14.3 32.9,14.33 29.56,10.98 25.17,10.98 v24.52,10.34 | v1.91,19.41 1.91,19.28 | U1.25 17.58,10.67 17.13,10.67 v16.8,10.34 16.98,10.15 v18.1,10.15
  Top 0.305: 1.91,18.39 1.91,18.9 | 1.91,19.28 1.91,19.15 | 1.91,19.15 1.91,18.9 | 1.91,18.9 2.29,18.52 1.91,18.52 1.79,18.64 1.41,18.64 | 1.53,18.77 1.91,19.15 | 1.91,19.28 2.42,18.77 1.53,18.77 | 1.53,18.77 1.41,18.64 | 1.41,18.64 1.28,18.64 | 1.28,18.64 1.91,19.28 | 1.28,18.64 1.28,18.77 v1.91,19.41
  Top 0.406: R2.2 1.91,18.39 R10.1
  Bottom 0.203: v1.91,19.41 2.85,18.47 2.85,12.9 6.1,9.65 16.2,9.65 | 16.2,9.65 16.4,9.86 | 16.2,9.65 16.22,9.65 | v24.52,10.34 23.76,11.1 19.11,11.1 18.16,10.15 v18.1,10.15 | v16.8,10.34 16.8,10.26 16.47,9.93 16.4,9.86 | 16.4,9.86 16.35,9.81
  Bottom 0.305: C18.1 1.66,19.15 v1.91,19.41
A3  (via drill 0.35)
  Top 0.203: U1.26 19.04,10.17 v18.96,10.08
  Bottom 0.203: 28.44,2.36 28.44,1.06 28.94,0.56 | 28.44,2.36 28.44,3.7 28.58,3.85 28.58,4.33 28.24,4.67 27.76,4.67 27.73,4.64 23.2,4.64 22.73,5.11 22.54,5.11 21.57,6.07 18.86,8.79 18.86,9.98 v18.96,10.08 | 28.41,2.34 28.44,2.36 | J8.3 51.7,0.56 28.94,0.56 | JP4.6 17.05,0.79 17.28,0.56 28.94,0.56
A4  (via drill 0.35)
  Top 0.203: J8.2 56.07,2.89 53.37,5.59 47.1,5.59 J3.1 44.56,8.13 38.26,8.13 | v31.17,5.26 32.98,5.26 v33.13,5.41 | 38.26,8.13 35.75,10.64 34.11,10.64 34.09,10.66 33.99,10.66 33.91,10.74 v33.56,10.74 | R24.1 38.26,7.29 38.26,8.13 | U1.27 19.84,10.12 v20.13,9.84 20.41,9.56 20.41,9.54 20.99,8.95 21.35,8.95 21.56,8.74 21.56,7.77 21.35,7.56 19.84,7.56 18.96,6.68 18.96,6.66 18.47,6.17 18.47,3.45 JP4.5
  Bottom 0.203: v31.17,5.26 23.73,5.26 23.68,5.31 23.68,5.87 23.32,6.22 22.11,6.22 19.95,8.38 19.95,9.66 v20.13,9.84 | v33.13,5.41 33.13,10.31 v33.56,10.74
A5  (via drill 0.35)
  Top 0.203: J8.1 58.61,1.32 58.53,1.25 35.01,1.25 v34.46,1.79 | R11.1 43.9,6.35 v43.9,6.2 | U1.28 v20.64,10.52 v20.63,10.52
  Bottom 0.203: 58.5,2.38 J8.1 55.45,5.54 49.41,5.54 | 49.41,5.54 49.21,5.54 48.37,6.38 J3.2 | v34.46,1.79 34.46,2.86 29.19,8.13 28.4,8.13 27.49,9.04 24.78,9.04 23.46,10.36 20.79,10.36 v20.63,10.52 | v43.9,6.2 44.46,5.64 49.31,5.64 49.41,5.54
A6  (via drill 0.35)
  Top 0.203: v50.02,36.45 56.67,36.45 J2.1 | v30.97,23.24 30.97,21.06 v29.3,19.38 | U1.19 16.78,16.79 19.01,16.79 v19.64,16.15
  Bottom 0.203: v50.02,36.45 47.61,34.04 38.85,34.04 30.97,26.16 v30.97,23.24 | v19.64,16.15 20.13,16.64 26.16,16.64 26.18,16.61 27.39,16.61 27.62,16.84 27.62,17.7 v29.3,19.38
A7  (via drill 0.35)
  Top 0.203: U1.22 v20.02,14.42 v20.02,14.43
  Bottom 0.203: J2.2 50.45,32.77 45.32,32.77 44.43,31.88 44.43,14.99 43.29,13.84 27.76,13.84 27.22,14.37 20.08,14.37 v20.02,14.43
D0/RX  (via drill 0.35)
  Top 0.203: v23.83,9.17 23.96,9.04 R21.2 | U1.30 22.24,10.22 v21.8,9.78
  Bottom 0.203: v21.8,9.78 23.22,9.78 v23.83,9.17
D1/TX
  Top 0.203: R20.2 22.39,9.2 23.04,9.85 U1.31
D2  (via drill 0.3, 0.35)
  Top 0.203: v42.78,28.32 42.78,29.85 U2.53 | v32.79,15.06 29.42,11.69 23.86,11.69 23.84,11.67 U1.32
  Bottom 0.203: v42.78,28.32 41.51,27.05 41.51,16.89 39.72,15.1 33.18,15.1 | 32.9,15.06 32.94,15.1 33.18,15.1 | 33.18,15.1 33.14,15.06 v32.79,15.06
D3  (via drill 0.3, 0.35)
  Top 0.203: 41.64,29.79 U2.54 41.77,29.67 v41.77,28.45 | v32.37,15.75 32.37,15.46 30.09,13.18 26.55,13.18 | 26.45,13.18 26.37,13.18 26.02,12.83 v26.02,12.62 | 26.45,13.18 26.55,13.18 | v26.02,12.62 25.12,12.62 24.98,12.77 | U1.1 26.09,12.82 26.45,13.18 | v26.02,12.62 25.87,12.77 | U1.1 26.19,12.82 26.55,13.18 | U1.1 25.82,12.82 v26.02,12.62
  Bottom 0.203: v32.37,15.75 39.61,15.75 41,17.14 41,27.69 v41.77,28.45
D4  (via drill 0.3, 0.35)
  Top 0.203: v30.59,14.48 29.9,13.79 v26.98,13.79 25.94,13.79 25.77,13.62 U1.2
  Top 0.254: D1.1 v35.79,14.49 v35.8,14.48
  Bottom 0.203: v30.59,14.48 31.1,14.48 | 31.1,14.48 v35.8,14.48 43.16,14.48 43.93,15.24 43.93,32.38 44.94,33.4 48.55,33.4 J2.3 | 31.1,14.48 30.84,14.73 | 30.59,14.99 30.84,14.73 | 30.84,14.73 30.84,14.61 30.72,14.61
  Bottom 0.254: J7.2 33.53,20.04 33.13,20.45 31.73,20.45 30.59,19.3 30.59,14.99 v30.59,14.48
D5  (via drill 0.3, 0.35)
  Top 0.203: U2.32 56.9,17.38 v56.88,17.4 | U1.9 23.84,21.29 v23.99,21.44
  Bottom 0.203: v56.88,17.4 59.17,17.4 60.69,18.92 60.69,38.61 59.67,39.62 52.23,39.62 J2.4 47.15,34.54 38.34,34.54 30.21,26.42 30.21,22.86 29.57,22.23 25.84,22.23 25.82,22.25 24.74,22.25 23.99,21.5 v23.99,21.44
D6  (via drill 0.35)
  Top 0.203: 25.88,23.22 25.88,23.99 v26.15,24.26 | 26.53,23.22 24.29,23.22 23.04,21.96 U1.10
  Top 0.254: Q1.1 26.53,23.22 25.88,23.22
  Bottom 0.203: J2.5 48.45,37.89 47.13,36.58 47.13,36.04 46.01,34.92 38.22,34.92 37.58,34.29 37.5,34.29 30.41,27.2 30.41,27.12 29.79,26.5 29.79,22.98 29.47,22.66 26.2,22.66 25.92,22.94 25.92,24.03 v26.15,24.26
D7/ESP-RX  (via drill 0.35)
  Top 0.203: U1.11 22.24,21.08 v21.8,21.51
  Top 0.406: ESP8266-MODULE.8 13.37,36.98 11.36,36.98 10.75,36.37 10.75,33.58 v14.51,29.82
  Bottom 0.203: J2.6 43.08,35.56 38.11,35.56 34.04,31.5 33.43,31.5 30.59,28.65 27.5,28.65 21.8,22.96 v21.8,21.51
  Bottom 0.406: v21.8,21.51 21.8,22.53 v14.51,29.82
D8/ESP-TX  (via drill 0.35)
  Top 0.203: 20.96,21.38 v20.99,21.41 | v21.62,24.21 20.96,23.54 20.96,21.38 | U1.12 21.44,20.9 20.96,21.38
  Top 0.406: ESP8266-MODULE.1 6.99,35.61 v13.06,29.54
  Bottom 0.203: v21.62,24.21 23,25.58 23.92,25.58 27.35,29.01 30.44,29.01 38.73,37.3 41.27,37.3 42.35,38.38 J2.7
  Bottom 0.406: 18.26,23.44 18.3,23.44 | 18.26,23.44 18.25,23.44 16.29,25.4 15.5,25.4 14.59,26.31 14.59,28.02 v13.06,29.54 | 18.26,23.44 18.64,23.06 19.34,23.06 v20.99,21.41
D9  (via drill 0.3, 0.35)
  Top 0.203: J2.8 40.88,38.33 40.88,33.53 v41.13,33.27 42.27,32.13 R14.1 | U2.9 38.3,18.58 37.83,19.05 37.83,29.72 v38.08,29.97 | v20,21.41 20,21.39 20.64,20.75 U1.13
  Bottom 0.203: 35.92,29.97 31.86,25.91 31.86,22.99 29.96,21.08 24.95,21.08 23.63,19.76 20.15,19.76 20.15,21.26 v20,21.41 | 35.92,29.97 39.23,33.27 v41.13,33.27 | v38.08,29.97 35.92,29.97
D10  (via drill 0.35)
  Top 0.203: v22.03,13.38 22.03,17.2 19.84,19.39 | J8.7 42.44,3.3 42.43,3.3 41.37,4.37 36.19,4.37 33.75,6.81 33.72,6.81 31.81,8.71 v29.07,8.71 | 19.79,19.69 19.79,19.51 19.79,19.43 19.84,19.39 | U1.14 19.84,19.39
  Top 0.305: U1.14 19.79,19.87 19.79,19.51
  Bottom 0.203: v29.07,8.71 28.84,8.94 28.84,10.25 28.22,10.87 26.95,10.87 24.44,13.38 v22.03,13.38
D11/MOSI  (via drill 0.3, 0.35)
  Top 0.203: D1.3 34.29,12.84 v34.3,12.82 | U1.15 19.04,20.52 v18.3,21.26 | v26.73,17.2 32.67,17.2 v32.83,17.35
  Top 0.254: v20.63,17.55 20.61,17.55 19.04,19.12 U1.15 | D1.3 34.29,15.89 v32.83,17.35
  Bottom 0.203: 34.65,18.92 34.65,18.91 J7.3 | 34.3,12.8 v34.3,12.82 37.55,12.82 | 37.55,12.82 37.55,12.83 | J8.8 39.52,3.68 38.39,3.68 35.24,6.83 35.24,10.18 37.55,12.48 37.55,12.82 | v20.63,17.55 20.99,17.2 v26.73,17.2 | v18.3,21.26 17.87,21.26 16.16,22.96 15.54,22.96 14.52,23.98 ICSP.4
  Bottom 0.254: J7.3 34.21,18.46 34.21,17.77 33.8,17.35 v32.83,17.35
D12/MISO  (via drill 0.35)
  Top 0.203: ICSP.1 17.76,24.72 v17.76,22.58 17.36,22.18 17.36,21.3 18.24,20.41 U1.16 | D1.6 v36.29,12.05
  Top 0.254: v36.29,12.05 37.19,12.95 37.19,14.99 v35.67,16.51
  Bottom 0.203: v36.29,12.05 34.73,10.49 34.73,5.74 38.09,2.38 J8.9
  Bottom 0.254: 39.1,19.05 38.97,18.92 | 38.97,18.92 39.1,18.92 | 38.97,18.92 39.01,18.89 J7.7 38.97,18.82 38.97,17.27 38.21,16.51 v35.67,16.51 | 31.73,21.97 31.5,21.97 30.23,20.7 25.11,20.7 23.79,19.38 19.99,19.38 19.77,19.6 19.77,20.67 18.73,21.71 18.73,21.72 17.87,22.58 v17.76,22.58
  Bottom 0.305: 39.1,19.05 39.1,20.7 37.83,21.97 31.73,21.97
D13/SCK  (via drill 0.35)
  Top 0.203: ICSP.3 14.84,25.09 14.84,21.31 | R19.2 13.62,21.31 14.84,21.31 | 14.84,21.31 15.55,21.31 15.81,21.06 15.81,20.02 16.47,19.35 16.47,18.69 U1.17 17.65,18.42 v18.47,17.6 | 35.06,12.47 35.05,12.46 | 35.12,12.54 35.06,12.47 | 35.06,12.47 v35.06,11.74 35.04,11.76 D1.5 | 34.91,16.79 34.91,16.84 31.73,20.02 31.73,20.9
  Top 0.254: 34.91,16.79 34.91,16.38 36.69,14.61 36.69,13.34 36.18,12.83 35.42,12.83 35.12,12.54 35.04,12.45 | 31.73,20.9 v31.73,21.08
  Bottom 0.203: J8.10 34.12,4 34.12,10.38 35.06,11.32 v35.06,11.74
  Bottom 0.254: 36.43,20.57 36.81,20.19 36.81,18.91 J7.5 | v31.73,21.08 31.19,21.08 30.4,20.3 25.36,20.3 24.01,18.95 19.82,18.95 v18.47,17.6
  Bottom 0.305: 36.43,20.57 35.92,21.08 v31.73,21.08
GND  (via drill 0.3, 0.35, 0.41)
  Top 0.203: Q1.2 28.67,23.96 v28.76,24.06 | 11.07,14.07 11.77,13.37 13.98,13.37 15.82,15.22 U1.21 | v8.44,15.67 7.68,14.9 USB1.8 | C28.2 10.5,14.3 v10.25,14.3 | C25.1 21.23,6.71 21.93,7.4 22.76,7.4 23.25,7.9 23.25,9.41 23.59,9.75 24.86,9.75 25.32,10.21 25.93,10.21 26.62,9.53 26.62,7.94 v26.68,7.87 | v27.77,12.57 26.79,12.57 26.26,12.04 24.84,12.04 23.96,12.92 23.96,13.96 24.64,14.63 25.58,14.63 | v28.61,6.73 28.79,6.91 28.79,7.37 29.13,7.71 31.57,7.71 31.6,7.68 v31.99,7.68 | D1.2 34.79,14.1 34.79,15.92 33.38,17.33 33.38,17.58 32.98,17.98 v29.02,17.98 28.8,18.21 28.8,18.48 28.65,18.63 27.94,18.63 X2.2 | v31.73,3.56 30.21,5.08 v30.21,6.1 | v27.16,34.29 27.16,34.99 27.23,35.06 27.23,36.76 +3V3-PWR.- | v28.76,5.99 28.76,5.32 28.7,5.26 28.7,3.82 JP4.2 | U1.3 25.6,14.69 26.07,14.69 26.22,14.84 26.22,15.61 26.1,15.73 | 26.1,15.73 26.1,15.79 23.33,15.79 v23.19,15.66 | U1.5 25.6,15.75 26.07,15.75 26.1,15.73 | C29.2 18.45,7.44 v18.45,7.42
  Top 0.254: U2.10 38.36,17.38 v38.21,17.53 | USB1.6 3.11,5.77 v3.31,5.56
  Top 0.305: v29.7,34.29 31.86,34.29 R13.2 | X2.2 27.47,18.95 v26.53,18.95
  Bottom 0.203: v28.76,24.06 28.76,24.6 J7.11 | IC3.21 13.39,19.3 v13.39,20.47 | IC3.25 16.17,20.02 v16.42,20.27 | v8.44,15.67 10.04,14.07 10.21,14.24 | 10.21,14.24 10.32,14.35 | v10.25,14.3 10.21,14.26 10.21,14.24 | v31.84,11.58 31.84,7.83 v31.99,7.68 | v29.02,17.98 28.63,17.59 J7.9 | v28.61,6.73 28.95,6.73 29.13,6.55 | v30.21,6.1 29.75,6.55 29.13,6.55 | v28.76,5.99 29.13,6.36 29.13,6.55 | v27.34,15.54 27.23,15.66 v23.19,15.66
  Bottom 0.254: IC3.25 16.17,18.27 16.14,18.24
  Bottom 0.305: C24.1 8.54,21.57 | 8.54,21.57 8.77,21.57 | 8.54,21.57 7.77,21.57 J1.2
  other vias: 34.58,36.09 21.04,25.27 19.21,26.24 1.63,10.87 1.63,12.45 2.17,27.41 62.85,22.61 2.17,29.06 64.37,22.48 2.17,26.64 2.17,28.17 1.41,21.95 2.17,21.95 1.13,34.16 7.58,37.13 1.28,23.22 2.04,23.22 50.91,15.75 31.61,2.16 4.84,4.93 20.81,3.99 6,6.88 58.4,9.78 56.24,6.73 57.51,9.78 53.83,3.94 51.29,3.94 48.88,3.94 64.63,4.7 57.67,4.98 19.36,21.97 18.93,23.77 39.48,39.5 47.74,36.32 44.69,39.62 47.23,39.62 51.29,17.27 48.62,15.88 24.98,21.67 23.07,5.61 50.4,27.05 46.97,24.64 42.78,19.18 39.89,10.74 61.66,10.13 62.75,8.61 35.42,3.81 51.55,35.18 46.97,16.51 50.66,24.51 51.42,24.51 51.29,27.05 43.16,33.27 49.89,16.76 48.88,16.89 64.37,33.27 63.48,33.27 57.51,31.75 57.77,32.64 57.64,35.05 61.58,1.27 2.17,29.95 23.48,27.56 29.7,33.4 1.91,36.3 1.03,35.15 1.03,36.17 2.68,35.92 1.91,35.41 42.02,39.57 46.21,28.07 49.13,18.03 50.15,18.16 42.91,22.61 40.27,11.48 62.98,24.89 63.74,24.89 64.5,25.02 41,31.62 33.82,24 32.62,22.73 33.13,24.64 34.96,28.02 28.76,26.49 8.39,21.41 16.92,15.22 18.22,16.04 8.06,32.64 3.46,33.32 17.51,5.64 19.57,6.43
  pour Bottom (isolate 0.305): -1.26,-0.79 70.91,-0.89 70.91,45.38 -1.26,45.48
  pour Top (isolate 0.305): -1.26,-0.79 70.91,-0.89 70.91,45.38 -1.26,45.48
GPS_RF
  Top 0.406: U2.28 L1.1 GPS.D
GSM_RF
  Top 0.406: U2.45 52.35,31.96 R6.1 51.08,32 C14.2
HRXD
  Top 0.203: U2.38 59.36,24.58 59.93,25.15 59.93,30.99 J4.1
HTXD
  Top 0.203: U2.37 61.08,23.38 61.96,24.26 J4.2
IO27  (via drill 0.3)
  Top 0.305: U2.26 54.75,9.56 v54.72,9.53 | v60.56,15.37 R3.1
  Bottom 0.305: v54.72,9.53 54.72,14.48 55.61,15.37 v60.56,15.37
IO28
  Top 0.305: U2.30 59.41,14.98 59.67,15.24 59.67,18.41 R4.1
N$1
  Top 0.305: R4.2 STA.+
N$2
  Top 1.016: D2.C 33.64,25.94 D3.A
N$3
  Top 0.406: +3V3-PWR.+ R7.2
N$4
  Top 0.203: C28.1 12.53,13.79 13.89,13.79 15.33,15.23 15.33,15.77 15.42,15.86 16.58,15.86 U1.20
N$5
  Top 0.203: R1.1 5.55,17.03 +5V5-PWR.A
N$6
  Top 0.203: IC4.3 15.91,5.31 14.79,4.19 13.7,4.19 13.59,4.08 13.51,4.08 13.14,3.71 13.14,2.31 13.01,2.18 12.02,2.18 C20.2 9.84,2.01 JP1.2
N$7
  Top 0.305: R3.2 NET.+
N$8
  Top 0.254: U2.18 45.07,10.8 45.07,9.65 44.81,9.4 39.99,9.4 37.96,11.43 37.96,15.11 34.74,18.33 34.15,18.92 34.15,18.95 34.15,22.3 32.47,23.98 29.7,23.98 28.43,25.25 Q1.3
N$9  (via drill 0.35)
  Top 0.203: v28,4.09 28,4.65 C23.2
  Bottom 0.203: v28,4.09 27.46,4.09 27.43,4.12 23.03,4.12 17.47,9.67 IC3.2
N$10
  Top 0.203: RX.C 12.26,14.91 13.83,14.91 R16.2
N$11
  Top 0.203: TX.C 11.79,17.02 R18.2
N$12  (via drill 0.35)
  Top 0.203: v15.01,20.39 14.79,20.17 14.79,18.2 14.59,18 R16.1
  Bottom 0.203: v15.01,20.39 15.01,19.27 IC3.23
N$13  (via drill 0.35)
  Top 0.406: R18.1 14.21,18.26 v14.21,20.27
  Bottom 0.406: v14.21,20.27 IC3.22
N$14  (via drill 0.35)
  Top 0.406: v8.37,19.43 7.66,19.43 7.6,19.49 5.02,19.49 4.25,18.73 4.25,12.72 4.2,12.67 4.2,11.43 5.55,10.08 USB1.3
  Bottom 0.406: IC3.15 9.36,19.43 v8.37,19.43
N$15  (via drill 0.35)
  Top 0.203: 8.26,10.88 USB1.4 7.51,10.88 7.5,10.87 6.26,10.87 6.05,11.07 6.05,12.32 6.28,12.55 7.91,12.55 v8.06,12.7
  Bottom 0.203: IC3.16 10.32,20.25 10.04,20.52 8.3,20.52 7.76,19.98 7.76,15.29 8.06,14.99 v8.06,12.7
N$16
  Top 0.203: R19.1 11.95,19.37 D13.A
N$25
  Top 0.406: CHG.- R12.1
N$26
  Top 0.406: IC1.1 28.62,35.24 R12.2
N$31
  Top 0.406: IC1.5 30.78,35.24 30.72,35.18 R13.1
N$44
  Top 0.203: U1.7 26.03,17.62 26.43,18.02 X2.3
N$49
  Top 0.203: X2.1 26.51,20.02 25.71,19.23 25.71,18.72 25.41,18.42 U1.8
N$94
  Top 0.406: C13.2 R6.2 GSM.D
RESET  (via drill 0.35)
  Top 0.203: ICSP.5 10.88,26.37 12.15,25.09 12.15,23.42 12.89,22.68 v13.14,22.68 | J8.11 32.69,2.9 31.48,2.9 29.6,4.78 C23.1 29.4,7.1 v29.37,7.13 31.29,7.13 RESET.2 | R22.2 25.58,5.59 v25.58,7.59 | v16.8,21.03 17.03,20.8 17.03,20.47 17.4,20.1 17.4,19.48 18.03,18.86 18.14,18.86 21.4,15.59 21.4,11.71 21.44,11.67 U1.29 21.44,10.78 21.33,10.67 | v20.99,9.78 21.22,10.01 21.22,10.02 21.33,10.13 21.33,10.67 | 21.33,10.67 21.33,10.99
  Bottom 0.203: v13.14,22.68 15.15,22.68 v16.8,21.03 | v20.99,9.78 21.22,9.55 21.22,9.54 21.56,9.2 22.91,9.2 23.73,8.38 24.79,8.38 | 24.79,8.38 v25.58,7.59 | v29.37,7.13 28.72,7.78 28.25,7.78 27.54,8.48 26.43,8.48 26.32,8.38 24.79,8.38
RX  (via drill 0.35)
  Top 0.203: v25.56,9.63 25.56,9.4 R21.1
  Bottom 0.203: IC3.1 18.37,11.76 23.96,11.76 24.76,10.96 24.9,10.82 25.1,10.62 25.56,10.16 v25.56,9.63
SIM_CLK  (via drill 0.3)
  Top 0.203: v55.36,20.83 55.36,26.92 56.63,28.19 58.15,28.19 U2.41
  Bottom 0.203: v55.36,20.83 55.27,20.74 U4.3 48.56,20.7 46.97,20.7 46.58,21.09 D5.4
SIM_DATA  (via drill 0.3)
  Top 0.203: v56.37,22.1 56.37,25.02 57.13,25.78 U2.39
  Bottom 0.203: v56.37,22.1 56.28,22.01 U4.7 48.62,21.98 48.62,21.97 48.37,22.23 46.08,22.23 45.83,21.97 D5.5
SIM_RST  (via drill 0.3)
  Top 0.203: v54.59,23.37 54.59,27.05 55.99,28.45 55.99,29.84 U2.42
  Bottom 0.203: D5.3 48.5,23.38 U4.2 54.51,23.28 v54.59,23.37
SIM_VDD  (via drill 0.3)
  Top 0.203: v56.5,26.92 58.15,26.92 58.15,26.93 | 58.15,26.93 58.28,27.05 58.15,27.05 | U2.40 58.15,26.93
  Bottom 0.203: v56.5,26.92 55.4,25.82 U4.1 48.56,25.78 45.7,25.78 45.08,25.16 D5.1
TX  (via drill 0.35)
  Top 0.203: v15.58,10.24 16.31,9.5 19.64,9.5 20.79,8.36 20.79,8.33 R20.1
  Bottom 0.203: IC3.5 15.52,10.3 v15.58,10.24
VBAT  (via drill 0.35)
  Top 0.305: J6.1 6.49,31.22 6.49,31.85 6.1,32.23
  Top 0.406: 27.48,33.34 v27.42,33.27
  Top 0.813: IC1.3 27.48,33.34
  Top 1.27: SW1.COM1 21.07,38.48 20.3,37.72 17.64,37.72 15.46,39.9 9.99,39.9 9.87,39.78 6.35,39.78 5.44,38.87 5.44,35.05 6.49,34 6.49,31.22
  Bottom 0.813: v27.42,33.27 19.56,33.27 17.48,31.2 J6.1
  Bottom 1.27: 25.79,38.38 25.13,37.72 22.59,37.72 SW1.COM1
VBAT_IN  (via drill 0.35)
  Top 0.508: R5.2 39.61,36.32 38.78,37.15 35.24,37.15 35.2,37.19 v34.12,37.19
  Top 0.559: v26.65,35.31 25,35.31
  Top 0.813: SW1.CH1A 23.99,39.24 25,38.23 25,35.31 25,34.92 R17.1 23.31,34.04 Q2.3
  Bottom 0.508: v26.65,35.31 31.1,35.31 32.94,37.15 33.72,37.15 33.75,37.19 v34.12,37.19
VBUS  (via drill 0.35)
  Top 0.406: USB1.5 9.43,11.68 10.33,10.78 10.33,7.66 v10.02,7.34
  Bottom 0.406: v10.02,7.34 10.31,7.63 D4.1
VCC  (via drill 0.35)
  Top 0.406: 31,38.41 v31.43,38.84 31.43,37.97 | 31,38.41 30.23,38.41 29.9,38.08 29.9,37.92 CHG.+ 30.07,38.09 31.31,38.09 | SW1.COM2 22.31,37.44 v22.31,40.21 | 31,38.41 31.31,38.09 | 31.31,38.09 31.43,37.97 | 32.65,32.28 32.9,32.28 33.22,32.6 | 32.65,32.28 31.5,32.28 31,32.79 IC1.4 31.74,32.6 33.22,32.6 | 33.59,32.97 33.22,32.6 | 33.59,32.97 33.59,35.61 32.27,36.93 | 33.94,32.51 C9.2 34.95,32.6 33.22,32.6 | 33.94,32.51 32.88,32.51 32.65,32.28 | 33.59,32.97 33.59,32.87 33.94,32.51 | 32.27,36.93 32.27,37.13 31.43,37.97 | 31.31,38.09 31.31,37.88 32.27,36.93
  Bottom 0.406: D4.3 10.69,5.46 5.55,5.46 5.52,5.44 0.68,10.27 0.68,11.73 0.68,22.81 0.57,22.92 0.57,24.87 | 0.57,24.87 0.57,25.3 | 0.57,25.3 0.57,25.88 | 0.57,25.88 0.57,30.58 0.82,30.84 | 22.19,40.33 29.94,40.33 v31.43,38.84 | v22.31,40.21 22.19,40.33 | 22.19,40.33 7.12,40.33 3.67,36.88 3.67,35.04 0.82,32.19 0.82,30.84 | 3.19,24.85 1.6,24.85 | 1.6,24.85 1.36,25.09 | 1.36,25.09 1.06,25.39 | 1.06,25.39 0.82,25.63 | 0.82,25.63 0.57,25.88 | 0.82,25.63 0.82,30.84 | 1.6,24.85 0.58,24.85 0.57,24.87 | 1.36,25.09 0.77,25.09 0.57,25.3 | 5.95,25.39 5.71,25.63 0.82,25.63 | 1.06,25.39 1.81,25.39 | 1.81,25.39 2.65,25.39 | 2.65,25.39 4.69,25.39 | 4.81,24.85 4.15,24.85 | 4.15,24.85 3.19,24.85 | 3.19,24.85 2.65,25.39 | 5.35,25.39 4.69,25.39 | 4.15,24.85 4.69,25.39 | 4.81,24.85 5.06,25.1 | 5.06,25.1 5.35,25.39 | 5.06,25.1 2.1,25.1 1.81,25.39 | 5.35,25.39 5.93,25.39 | 4.81,24.85 5.39,24.85 | 5.39,24.85 6.03,24.85 | 5.95,25.39 6.03,25.31 | 6.03,25.31 6.03,24.85 | 6.03,24.85 J1.1 6.03,25.31 | 5.39,24.85 5.93,25.39 | 5.93,25.39 5.95,25.39
VIN  (via drill 0.35)
  Top 0.203: v41.46,13.26 41.84,13.26 41.92,13.34 42.63,13.34 43.47,14.17 | D3.C 34.46,30.5 34.46,30.49 | J2.11 32.72,37.9 32.72,37.12 34.1,35.75 34.1,33.72 34.6,33.21 35.52,33.21 35.73,33 35.73,32.03 35.52,31.81 32.81,31.81 32.72,31.73 | U1.4 25.19,15.08 22.7,15.08 v22.61,14.99 22.61,16.66 22.77,16.82 U1.6
  Top 0.254: U2.11 38.03,16.18 36.31,17.91 C16.A | C8.2 36.18,28.47 | 34.15,30.73 33.26,31.62 | 43.07,14.57 43.05,14.57 42.38,15.24
  Top 0.305: C8.2 C12.2 36.18,21.08 C16.A | U2.12 42.66,14.98 43.07,14.57 43.47,14.17 44.81,12.83 55.99,12.83 57.77,11.05 L1.2 60.44,9.7 60.71,9.42 60.79,9.42 R9.1 | 35.19,29.08 35.21,29.11 35.21,29.23 | 20.61,30.28 20.6,30.29 | v11.92,9 11.15,9.77 11.15,11.57 9.05,13.67 9.05,14.97 RX.A | U1.18 16.66,17.53 v15.73,17.53
  Top 0.406: U2.11 U2.12 | 20.57,31.62 Q2.2 | 33.26,31.62 24.11,31.62 | 24.11,31.62 22.84,31.62 | 22.84,31.62 20.57,31.62 | R17.2 24.11,31.62 | C10.2 24.11,30.23 24.11,31.62 | 22.84,30.63 22.84,31.62 | 39.99,16.13 39.96,16.15 39.96,16.38 38.16,16.38 36.81,17.73 36.81,30.3 35.85,31.27 33.71,31.27 33.26,31.73 32.72,31.73 27.67,31.73 26.58,32.82 26.17,32.82 | 20.49,30.2 20.61,30.2 | 24.47,29.72 24.09,29.72 23.61,30.2 22.49,30.2 22.49,31.29 22.31,31.47 21.04,31.47 20.43,30.86 20.43,30.76 20.41,30.79 20.41,31.52 21.09,32.21 21.09,32.38 21.22,32.26 23.68,32.26 23.96,31.98 20.43,31.98 20.35,31.9 20.35,30.53 20.61,30.28 U5.8 | 24.62,29.72 24.47,29.72 | 24.47,29.72 23.76,30.43 23.05,30.43 23.02,30.46 23.02,30.73 | 23.02,30.73 23.02,31.24 23.12,31.34 23.81,31.34 23.83,31.32 23.83,30.79 23.86,30.76 23.35,30.76 23.33,30.73 23.33,30.99 23.61,31.27 23.61,31.01 23.94,31.01 24.6,30.35 25.66,31.42 32.65,31.42 33,31.06 33,29.39 33.31,29.08 35.19,29.08 36,28.27 36,18.03 38.95,15.09 40.34,15.09 | 42.4,15.09 40.34,15.09 | 40.34,15.09 40.04,14.78 40.04,16.38 41.23,16.38 42.38,15.24 42.58,15.04 | 33.11,29.57 34.88,29.57 35.21,29.23 33.56,29.23 33.44,29.36 | 36.25,28.7 34.46,30.49 33.51,31.45 33.08,31.45 33.46,31.06 35.59,31.06 36.48,30.18 36.53,30.18 36.53,17.83 38.52,15.85 40.85,15.85 41.28,15.42 41.64,15.42 41.61,15.44 39.15,15.44 38.49,16.1 38.34,16.1 38.39,16.15 41,16.15 42.05,15.11 42.38,15.11 42.4,15.09 | 36.25,28.7 36.25,24.99 | 36.25,28.7 36.25,29.95 35.42,30.79 35.42,29.82 36,29.23 36,29.74 35.57,30.18 | 42.5,15.09 42.4,15.09 | C17.2 26.48,32.51 | 26.48,32.51 27.19,31.8 25.64,31.8 24.52,30.68 24.52,31.09 24.82,31.39 24.47,31.39 24.34,31.27 24.34,32 24.6,32.26 26.45,32.26 26.68,32.03 24.62,32.03 24.44,31.85
  Top 0.406: R1.2 7.68,18.69 8.8,17.58 | RX.A 9.53,15.54 TX.A 9.36,17.02 8.8,17.58 | C27.A 24.44,6.78 | 24.44,6.78 24.44,5.21 R22.1 24.85,2.51 JP4.3 | C25.2 24.37,6.71 24.44,6.78 | C25.2 22.34,6.71 20.91,5.28 | 26.17,32.82 23.88,32.82 23.12,32.05 21.93,32.05 21.27,32.72 20.28,32.72 20.13,32.56 20.13,30.56 20.48,30.2 20.49,30.2 | 26.17,32.82 26.48,32.51 | v8.8,17.02 8.8,17.58 | C25.2 20.99,5.28 | 20.99,5.28 20.91,5.28 | 20.91,5.28 20.86,5.28 C26.1 20.94,5.23 20.99,5.28 | U5.5 22.98,30.73 23.02,30.73 | U5.8 20.57,31.62 | U5.8 20.49,30.2
  Bottom 0.203: v15.73,17.53 18.25,15.01 18.47,15.01 | 19.44,15.01 20.26,15.01 20.29,14.99 v22.61,14.99 | 19.44,15.01 19.03,15.01 | 19.03,15.01 18.86,15.01 | 18.86,15.01 18.58,15.01 | 18.58,15.01 18.47,15.01 | v41.46,13.26 34.72,13.26 34.49,13.49 27.5,13.49 27.22,13.21 26.08,13.21 25.32,13.96 21.79,13.96 21.6,13.78 21.53,13.78 | 18.93,14.02 19.09,14.18 | 19.09,14.18 19.21,14.18 | 19.21,14.18 19.42,14.18 | 19.17,13.78 19.21,13.81 19.21,13.97 | 19.21,13.97 19.21,14.18 | 19.21,13.97 19.25,14.01 19.58,14.01 | 19.44,15.01 19.2,14.77 | 19.2,14.77 19.09,14.66 19.09,14.18 | 19.2,14.77 19.21,14.76 19.21,14.18 | 19.03,15.01 19.03,14.32 18.91,14.2 | 18.91,14.2 18.73,14.02 | 18.45,14.02 18.47,14.04 18.47,15.01 | 18.73,14.02 18.58,14.17 18.58,15.01 | 18.73,14.02 18.73,14.88 18.86,15.01 | 18.91,14.2 18.91,14.96 18.86,15.01
  Bottom 0.254: 21.56,13.78 21.53,13.78 | 20.28,13.82 19.77,13.82 19.58,14.01 19.42,14.18 19.42,14.68 19.77,15.03 20.28,15.03 20.32,14.99 v22.61,14.99
  Bottom 0.305: 21.53,13.78 19.17,13.78 18.93,14.02 18.73,14.02 18.45,14.02 17.29,14.02 16.32,13.04 16.32,12.68 16.17,12.52 IC3.4 16.17,17.09 v15.73,17.53
  Bottom 0.406: v15.73,17.53 15.65,17.45 13.24,17.45 | IC3.20 12.92,17.77 13.24,17.45 | 13.24,17.45 10.32,17.45 9.89,17.02 v8.8,17.02 | 20.72,5.28 20.79,5.21 | v11.92,9 15.78,9 19.5,5.28 20.72,5.28 | 20.72,5.28 20.81,5.28 C26.1
  other vias: 20.86,5.23
VIO  (via drill 0.3)
  Top 0.305: R14.2 45.7,32.13 v45.83,32 | v54.72,28.32 54.72,29.85 U2.43
  Bottom 0.305: v45.83,32 53.7,32 54.72,30.99 v54.72,28.32
VSYS  (via drill 0.35)
  Top 0.305: 23.99,36.83 24.04,36.83
  Top 0.406: 3.69,17.5 3.69,25.5 | 3.69,25.5 3.69,25.76 5.09,27.15 | v19.16,29.72 19.16,30.35 | 19.16,30.35 19.16,32.94 Q2.1 21.76,34.35 21.83,34.42 | R15.1 26.4,30.1 | SW1.CH2A 21.83,34.42 | 21.83,34.42 20.56,34.42 19.86,33.72 | 19.86,33.72 19.16,33.02 | R10.2 3.06,16.87 3.69,17.5 | 30.7,29.97 D2.A | 2.42,17.14 3.03,17.14 3.59,17.7 3.59,19.23 3.26,19.56 3.26,25.17 3.26,26.01 4.94,27.69 7.25,27.69 | 17.92,27.69 17.81,27.58 16.47,27.58 16.42,27.64 | 18.88,28.65 18.88,33.63 19.87,34.62 21.42,34.62 22.67,35.87 22.67,36.47 23.2,37.01 23.91,37.01 | 23.91,37.01 24.04,36.88 24.04,36.83 24.04,36.6 21.47,34.04 20.41,34.04 19.31,32.94 | 5.83,27.64 3.69,25.5 | 3.69,25.5 3.49,25.5 | 3.49,25.5 3.49,19.56 | 3.49,25.5 3.49,25.91 4.99,27.41 | 18.98,33.27 20.07,34.37 21.5,34.37 23.83,36.7 23.45,36.7 | 23.45,36.7 23.38,36.78 23.38,36.65 22.82,36.09 22.82,36.12 | 22.49,35.28 23.4,35.28 24.04,35.92 24.04,36.78 23.99,36.83 23.99,36.25 23.25,35.51 | 2.47,17.12 2.42,17.07 2.42,16.54 2.47,16.48 3.26,16.48 3.69,16.92 3.69,17.2 | 3.69,17.5 3.69,17.2 | 3.69,17.2 3.21,16.71 | 5.83,27.64 10.42,27.64 | 4.99,27.41 6.97,27.41 | 6.97,27.41 10.19,27.41 10.42,27.64 | 16.42,27.64 17.53,27.64 | 17.92,27.69 18.88,28.65 | 16.42,27.64 10.42,27.64 | 5.83,27.64 5.22,27.64 4.99,27.41 | 6.97,27.41 7.25,27.69 | 7.25,27.69 17.92,27.69 | 19.86,33.72 19.86,33.09 19.57,32.8 19.57,30.76 | v19.16,29.72 19.57,30.12 19.57,30.76 | v19.16,29.72 19.16,28.93 18.88,28.65 | 19.57,30.76 19.16,30.35 | SW1.CH2A 23.61,36.7 23.91,37.01 | SW1.CH2A 23.61,36.55 23.45,36.7
  Top 0.61: 26.4,30.1 v25.64,30.1
  Top 1.016: R15.1 30.7,29.97
  Bottom 1.016: v25.64,30.1 25.26,29.72 22.56,29.72 v19.16,29.72
(copper drawn outside any net)
  shapes: Top area x2

### Text on the board
tPlace: GND | RX | VIN | GND | 3V3 | D9 | D8 | D7 | D6 | D5 | D4 | A7 | A6 | OFF | ON | VBAT | TX | +3V3 | + | RESET | HRX | HTX | GND | - | SCK | MISO | + | GND | - | 16MHz XTAL | ATMEGA328P-AU | MOSI | +5V5 | CHG | SDA | SCL | 3V3 | GND | LM1117IMPX-5.0 | RST | D13 | D12 | D11 | D10 | A0 | A1 | A2 | A3 | A4 | A5 | - | + | SIM7600E | DC 6V-12V | GND | RX | TX | VIN | GND
bNames: Pronto Micro-Sysytems Technology Limited | Pro-Tracker v1.2 | www.pmtl.ng | A9 | A9G | 328P